# Altium schematic sheet cpld.SchDoc
size A4
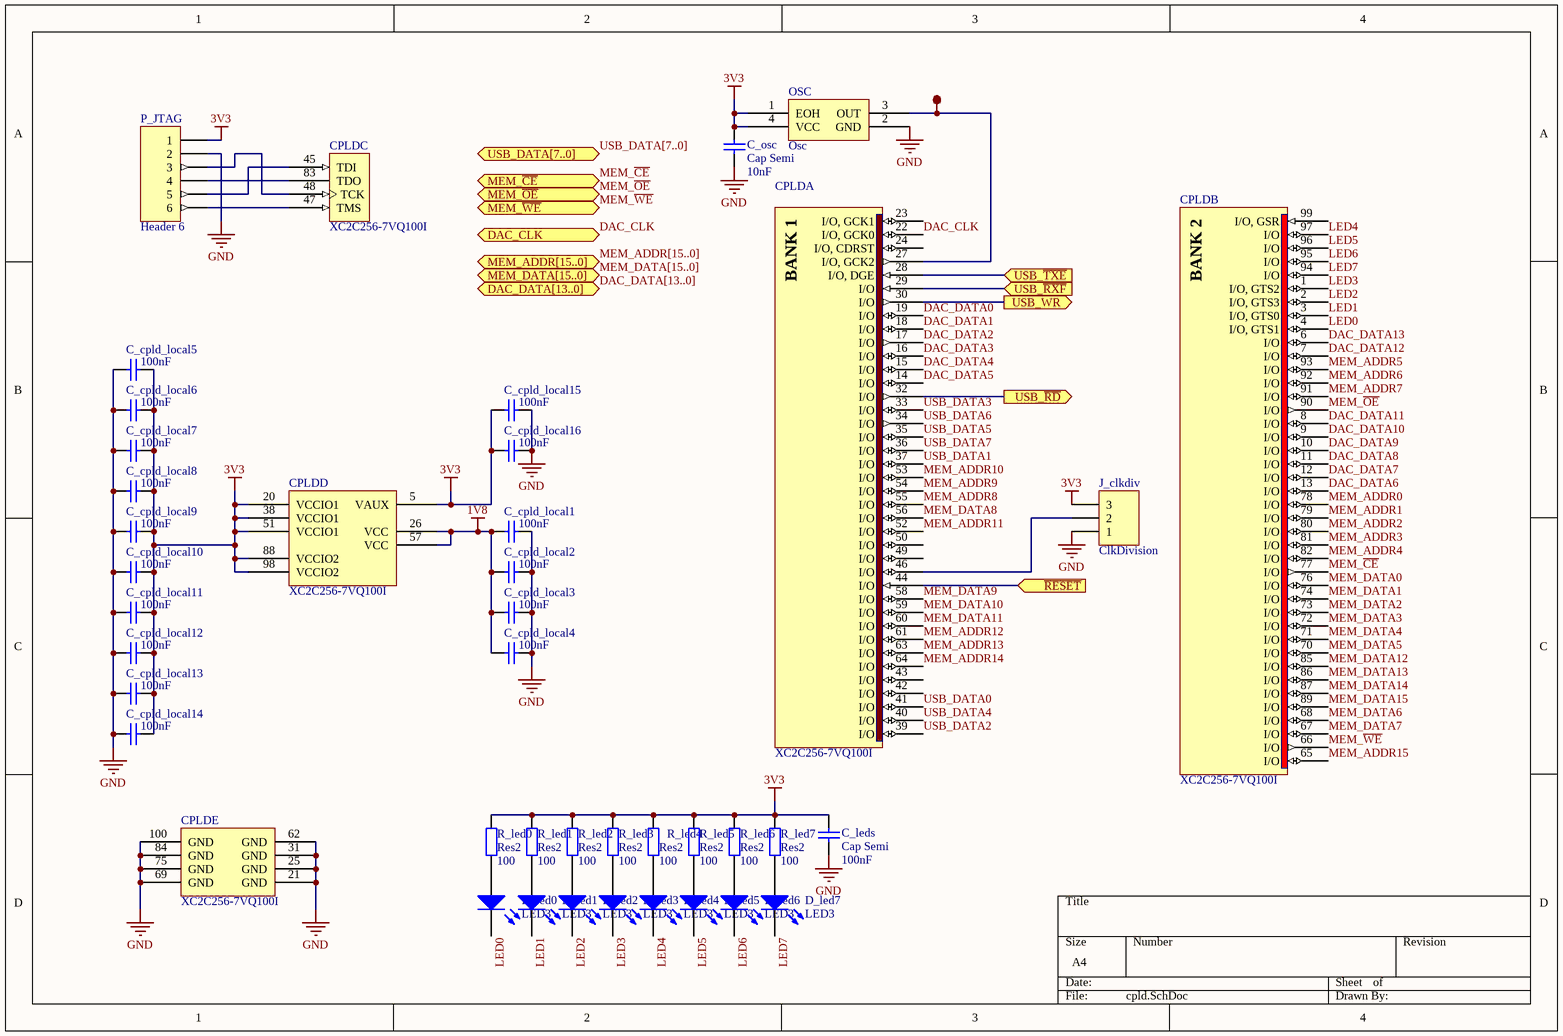
[diagram p0: cpld.SchDoc]

## Parts
C_cpld_local1  value 100nF  [0805]  (hidden comment: Cap Semi)
C_cpld_local2  value 100nF  [0805]  (hidden comment: Cap Semi)
C_cpld_local3  value 100nF  [0805]  (hidden comment: Cap Semi)
C_cpld_local4  value 100nF  [0805]  (hidden comment: Cap Semi)
C_cpld_local5  value 100nF  [0805]  (hidden comment: Cap Semi)
C_cpld_local6  value 100nF  [0805]  (hidden comment: Cap Semi)
C_cpld_local7  value 100nF  [0805]  (hidden comment: Cap Semi)
C_cpld_local8  value 100nF  [0805]  (hidden comment: Cap Semi)
C_cpld_local9  value 100nF  [0805]  (hidden comment: Cap Semi)
C_cpld_local10  value 100nF  [0805]  (hidden comment: Cap Semi)
C_cpld_local11  value 100nF  [0805]  (hidden comment: Cap Semi)
C_cpld_local12  value 100nF  [0805]  (hidden comment: Cap Semi)
C_cpld_local13  value 100nF  [0805]  (hidden comment: Cap Semi)
C_cpld_local14  value 100nF  [0805]  (hidden comment: Cap Semi)
C_cpld_local15  value 100nF  [0805]  (hidden comment: Cap Semi)
C_cpld_local16  value 100nF  [0805]  (hidden comment: Cap Semi)
C_leds  Cap Semi  value 100nF  [0805]
C_osc  Cap Semi  value 10nF  [0805]
CPLD  XC2C256-7VQ100I  [VQ100_N]  (parts A,B,C,D,E of 5)
D_led0  LED3  [0805]
D_led1  LED3  [0805]
D_led2  LED3  [0805]
D_led3  LED3  [0805]
D_led4  LED3  [0805]
D_led5  LED3  [0805]
D_led6  LED3  [0805]
D_led7  LED3  [0805]
J_clkdiv  ClkDivision  [HDR1X3]
OSC  Osc  [OSC]
P_JTAG  Header 6  [HDR1X6]
R_led0  Res2  value 100  [0805]
R_led1  Res2  value 100  [0805]
R_led2  Res2  value 100  [0805]
R_led3  Res2  value 100  [0805]
R_led4  Res2  value 100  [0805]
R_led5  Res2  value 100  [0805]
R_led6  Res2  value 100  [0805]
R_led7  Res2  value 100  [0805]
TP_osc  TestPoint  [testpoint]  (value not drawn)

## Ports
DAC_CLK (out), DAC_DATA[13..0] (out), MEM_ADDR[15..0] (out), MEM_DATA[15..0] (bidir), MEM_~{CE} (out), MEM_~{OE} (out), MEM_~{WE} (out), USB_DATA[7..0] (bidir), USB_WR (out), USB_~{RD} (out), USB_~{RXF} (in), USB_~{TXE} (in), ~{RESET} (in)

## Nets
1V8: C_cpld_local1.2 C_cpld_local2.2 C_cpld_local3.2 C_cpld_local4.2 CPLD.26(VCC) CPLD.57(VCC)
3V3: C_cpld_local5.1 C_cpld_local6.1 C_cpld_local7.1 C_cpld_local8.1 C_cpld_local9.1 C_cpld_local10.1 C_cpld_local11.1 C_cpld_local12.1 C_cpld_local13.1 C_cpld_local14.1 C_cpld_local15.2 C_cpld_local16.2 C_leds.2 C_osc.2 CPLD.5(VAUX) CPLD.20(VCCIO1) CPLD.38(VCCIO1) CPLD.51(VCCIO1) CPLD.88(VCCIO2) CPLD.98(VCCIO2) J_clkdiv.3 OSC.1(EOH) OSC.4(VCC) P_JTAG.1 R_led0.2 R_led1.2 R_led2.2 R_led3.2 R_led4.2 R_led5.2 R_led6.2 R_led7.2
GND: C_cpld_local1.1 C_cpld_local2.1 C_cpld_local3.1 C_cpld_local4.1 C_cpld_local5.2 C_cpld_local6.2 C_cpld_local7.2 C_cpld_local8.2 C_cpld_local9.2 C_cpld_local10.2 C_cpld_local11.2 C_cpld_local12.2 C_cpld_local13.2 C_cpld_local14.2 C_cpld_local15.1 C_cpld_local16.1 C_leds.1 C_osc.1 CPLD.21(GND) CPLD.25(GND) CPLD.31(GND) CPLD.62(GND) CPLD.69(GND) CPLD.75(GND) CPLD.84(GND) CPLD.100(GND) J_clkdiv.1 OSC.2(GND) P_JTAG.2
DAC_CLK: CPLD.22(I/O,_GCK0) ; port DAC_CLK
DAC_DATA0: CPLD.19(I/O)
DAC_DATA1: CPLD.18(I/O)
DAC_DATA2: CPLD.17(I/O)
DAC_DATA3: CPLD.16(I/O)
DAC_DATA4: CPLD.15(I/O)
DAC_DATA5: CPLD.14(I/O)
DAC_DATA6: CPLD.13(I/O)
DAC_DATA7: CPLD.12(I/O)
DAC_DATA8: CPLD.11(I/O)
DAC_DATA9: CPLD.10(I/O)
DAC_DATA10: CPLD.9(I/O)
DAC_DATA11: CPLD.8(I/O)
DAC_DATA12: CPLD.7(I/O)
DAC_DATA13: CPLD.6(I/O)
LED0: CPLD.4(I/O,_GTS1) D_led0.2(K)
LED1: CPLD.3(I/O,_GTS0) D_led1.2(K)
LED2: CPLD.2(I/O,_GTS3) D_led2.2(K)
LED3: CPLD.1(I/O,_GTS2) D_led3.2(K)
LED4: CPLD.97(I/O) D_led4.2(K)
LED5: CPLD.96(I/O) D_led5.2(K)
LED6: CPLD.95(I/O) D_led6.2(K)
LED7: CPLD.94(I/O) D_led7.2(K)
MEM_ADDR0: CPLD.78(I/O)
MEM_ADDR1: CPLD.79(I/O)
MEM_ADDR2: CPLD.80(I/O)
MEM_ADDR3: CPLD.81(I/O)
MEM_ADDR4: CPLD.82(I/O)
MEM_ADDR5: CPLD.93(I/O)
MEM_ADDR6: CPLD.92(I/O)
MEM_ADDR7: CPLD.91(I/O)
MEM_ADDR8: CPLD.55(I/O)
MEM_ADDR9: CPLD.54(I/O)
MEM_ADDR10: CPLD.53(I/O)
MEM_ADDR11: CPLD.52(I/O)
MEM_ADDR12: CPLD.61(I/O)
MEM_ADDR13: CPLD.63(I/O)
MEM_ADDR14: CPLD.64(I/O)
MEM_ADDR15: CPLD.65(I/O)
MEM_~{CE}: CPLD.77(I/O) ; port MEM_~{CE}
MEM_DATA0: CPLD.76(I/O)
MEM_DATA1: CPLD.74(I/O)
MEM_DATA2: CPLD.73(I/O)
MEM_DATA3: CPLD.72(I/O)
MEM_DATA4: CPLD.71(I/O)
MEM_DATA5: CPLD.70(I/O)
MEM_DATA6: CPLD.68(I/O)
MEM_DATA7: CPLD.67(I/O)
MEM_DATA8: CPLD.56(I/O)
MEM_DATA9: CPLD.58(I/O)
MEM_DATA10: CPLD.59(I/O)
MEM_DATA11: CPLD.60(I/O)
MEM_DATA12: CPLD.85(I/O)
MEM_DATA13: CPLD.86(I/O)
MEM_DATA14: CPLD.87(I/O)
MEM_DATA15: CPLD.89(I/O)
MEM_~{OE}: CPLD.90(I/O) ; port MEM_~{OE}
MEM_~{WE}: CPLD.66(I/O) ; port MEM_~{WE}
~{RESET}: CPLD.44(I/O) ; port ~{RESET}
USB_DATA0: CPLD.41(I/O)
USB_DATA1: CPLD.37(I/O)
USB_DATA2: CPLD.39(I/O)
USB_DATA3: CPLD.33(I/O)
USB_DATA4: CPLD.40(I/O)
USB_DATA5: CPLD.35(I/O)
USB_DATA6: CPLD.34(I/O)
USB_DATA7: CPLD.36(I/O)
USB_~{RD}: CPLD.32(I/O) ; port USB_~{RD}
USB_~{RXF}: CPLD.29(I/O) ; port USB_~{RXF}
USB_~{TXE}: CPLD.28(I/O,_DGE) ; port USB_~{TXE}
USB_WR: CPLD.30(I/O) ; port USB_WR
NetCPLD_27: CPLD.27(I/O,_GCK2) OSC.3(OUT) TP_osc.1(TP)
NetCPLD_45: CPLD.45(TDI) P_JTAG.5
NetCPLD_46: CPLD.46(I/O) J_clkdiv.2
NetCPLD_47: CPLD.47(TMS) P_JTAG.6
NetCPLD_48: CPLD.48(TCK) P_JTAG.3
NetCPLD_83: CPLD.83(TDO) P_JTAG.4
NetD_led0_1: D_led0.1(A) R_led0.1
NetD_led1_1: D_led1.1(A) R_led1.1
NetD_led2_1: D_led2.1(A) R_led2.1
NetD_led3_1: D_led3.1(A) R_led3.1
NetD_led4_1: D_led4.1(A) R_led4.1
NetD_led5_1: D_led5.1(A) R_led5.1
NetD_led6_1: D_led6.1(A) R_led6.1
NetD_led7_1: D_led7.1(A) R_led7.1

Not connected (* = marked no-connect by the designer): CPLD 23(I/O,_GCK1) 24(I/O,_CDRST) 42(I/O) 43(I/O) 49(I/O) 50(I/O) 99(I/O,_GSR)

## Buses and harness runs
bus DAC_DATA[13..0] = port DAC_DATA[13..0]
bus MEM_ADDR[15..0] = port MEM_ADDR[15..0]
bus MEM_DATA[15..0] = port MEM_DATA[15..0]
bus USB_DATA[7..0] = port USB_DATA[7..0]

## Notes on the sheet
- (in symbol XC2C256-7VQ100I, part A) BANK 1
- (in symbol XC2C256-7VQ100I, part B) BANK 2

## Library data of the parts
C_cpld_local1-C_cpld_local16 C_leds C_osc = Cap Semi: Capacitor (Semiconductor SIM Model); Published: 8-Jun-2000; LatestRevisionDate: 29-May-2009; LatestRevisionNote: IPC-7351 Footprint Added.; PackageReference: C1206; Publisher: Altium Limited; PackageDescription: Chip Capacitor
CPLD = XC2C256-7VQ100I: CoolRunner-II 1.8V, 256 Macrocell CPLD, 80 User I/Os, 100-Pin VQFP, Industrial Grade; FirstPublished: 23-Sep-2002; LatestRevisionDate: 30-Oct-2009; LatestRevisionNote: Updated to datasheet version 3.1 Sep-2008.; DatasheetVersion: ver3.2, Mar-2007; PackageVersion: ver1.2.1, Feb-2007; PackageReference: VQ100; Publisher: Altium Limited; PackageDescription: 100-Pin Very Thin Quad Flat Pack (VQ100); Code_JEDEC: MS-026-AED; ComponentLink1Description: XC2C256 Datasheet; ComponentLink1URL: http://www.xilinx.com/support/documentation/data_sheets/ds094.pdf; ComponentLink2Description: VQ100 Package Drawing; ComponentLink2URL: http://www.xilinx.com/support/documentation/package_specs/vq100.pdf; ComponentLink3Description: CoolRunner-II Documents; ComponentLink3URL: http://www.xilinx.com/support/documentation/coolrunner-ii.htm; ComponentLink4Description: Xilinx.com Home; ComponentLink4URL: http://www.xilinx.com
D_led0-D_led7 = LED3: Typical BLUE SiC LED; Published: 8-Jun-2000; LatestRevisionDate: 17-Dec-2003; LatestRevisionNote: PCB Footprint replaced.; DatasheetVersion: 16-Apr-2002; PackageVersion: 16-Apr-2002; PackageReference: 3.5X2.8X1.9; Publisher: Altium Limited
J_clkdiv = Header 3: Header, 3-Pin; LatestRevisionDate: 17-Jul-2002; LatestRevisionNote: Re-released for DXP Platform.; Publisher: Altium Limited
P_JTAG = Header 6: Header, 6-Pin; LatestRevisionDate: 17-Jul-2002; LatestRevisionNote: Re-released for DXP Platform.; Publisher: Altium Limited
R_led0-R_led7 = Res2: Resistor; Published: 8-Jun-2000; LatestRevisionDate: 17-Jul-2002; LatestRevisionNote: Re-released for DXP Platform.; PackageReference: AXIAL-0.4; Publisher: Altium Limited